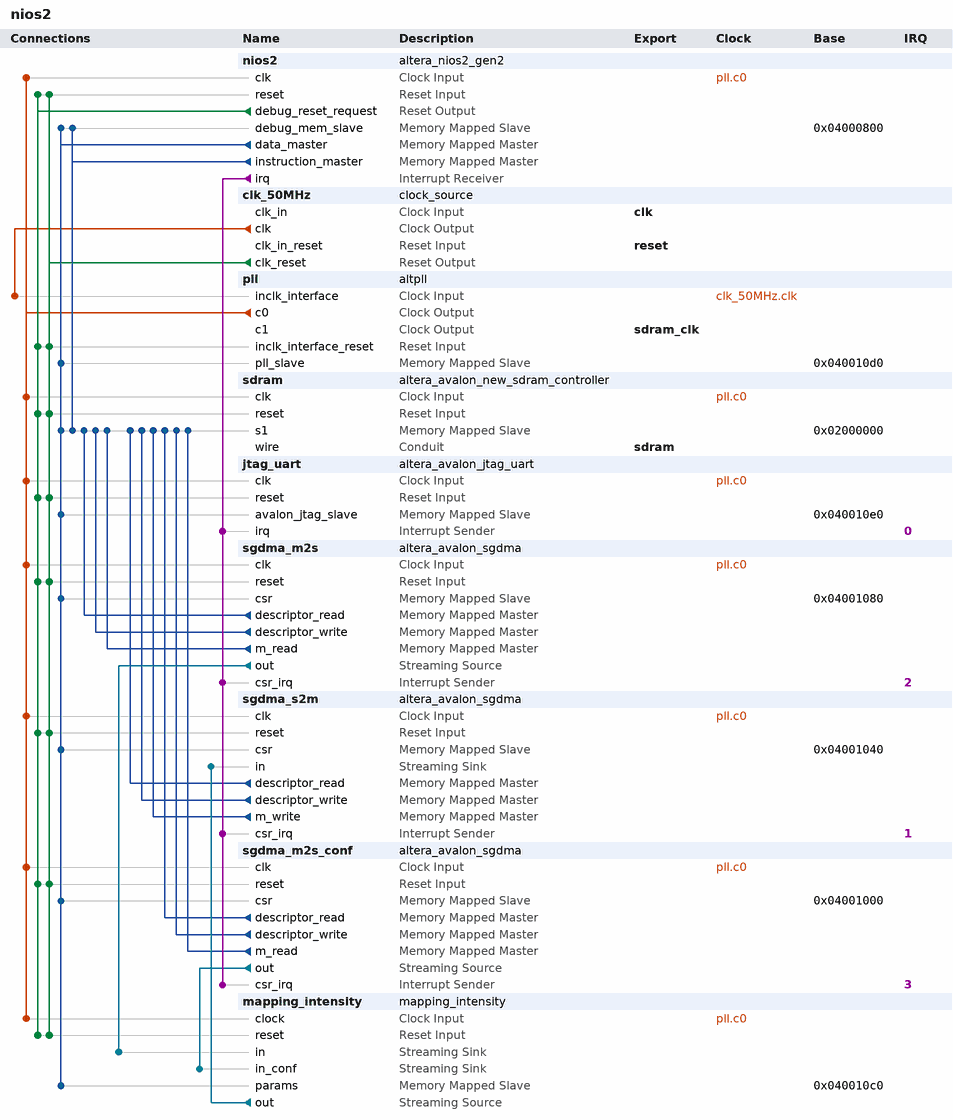
[diagram p0: system contents]
# Platform Designer (Qsys) system nios2, Cyclone IV E EP4CE22F17C6
# Parameters at their usual value, and those the tool derives, are not listed.
package require -exact qsys 17.1
create_system nios2
set_project_property DEVICE_FAMILY {Cyclone IV E}
set_project_property DEVICE EP4CE22F17C6

add_instance nios2 altera_nios2_gen2 17.1
set_instance_parameter_value nios2 dcache_size 2048
set_instance_parameter_value nios2 exceptionSlave sdram.s1
set_instance_parameter_value nios2 icache_size 4096
set_instance_parameter_value nios2 impl Tiny
set_instance_parameter_value nios2 resetSlave sdram.s1

add_instance clk_50MHz clock_source 17.1
set_instance_parameter_value clk_50MHz clockFrequency 50000000

add_instance pll altpll 17.1
set_instance_parameter_value pll CLK0_DIVIDE_BY 1
set_instance_parameter_value pll CLK0_MULTIPLY_BY 1
set_instance_parameter_value pll CLK0_PHASE_SHIFT 3000
set_instance_parameter_value pll CLK1_DIVIDE_BY 1
set_instance_parameter_value pll CLK1_DUTY_CYCLE 50
set_instance_parameter_value pll CLK1_MULTIPLY_BY 1
set_instance_parameter_value pll CLK1_PHASE_SHIFT 0
set_instance_parameter_value pll INCLK0_INPUT_FREQUENCY 20000
set_instance_parameter_value pll PORT_ARESET PORT_UNUSED
set_instance_parameter_value pll PORT_LOCKED PORT_UNUSED
set_instance_parameter_value pll PORT_clk1 PORT_USED
set_instance_parameter_value pll PORT_clk2 PORT_UNUSED
set_instance_parameter_value pll PORT_clk3 PORT_UNUSED

add_instance sdram altera_avalon_new_sdram_controller 17.1
set_instance_parameter_value sdram TAC 5.5
set_instance_parameter_value sdram TRCD 20.0
set_instance_parameter_value sdram TRP 20.0
set_instance_parameter_value sdram casLatency 3
set_instance_parameter_value sdram columnWidth 9
set_instance_parameter_value sdram dataWidth 16
set_instance_parameter_value sdram generateSimulationModel false
set_instance_parameter_value sdram model single_Micron_MT48LC4M32B2_7_chip
set_instance_parameter_value sdram numberOfBanks 4
set_instance_parameter_value sdram numberOfChipSelects 1
set_instance_parameter_value sdram powerUpDelay 100.0
set_instance_parameter_value sdram refreshPeriod 15.625
set_instance_parameter_value sdram rowWidth 13

add_instance jtag_uart altera_avalon_jtag_uart 17.1
set_instance_parameter_value jtag_uart simInteractiveOptions NO_INTERACTIVE_WINDOWS

add_instance sgdma_m2s altera_avalon_sgdma 17.1
set_instance_parameter_value sgdma_m2s enableBurstTransfers false
set_instance_parameter_value sgdma_m2s enableUnalignedTransfers false
set_instance_parameter_value sgdma_m2s readBlockDataWidth 8
set_instance_parameter_value sgdma_m2s sinkErrorWidth 0
set_instance_parameter_value sgdma_m2s sourceErrorWidth 0
set_instance_parameter_value sgdma_m2s transferMode MEMORY_TO_STREAM
set_instance_parameter_value sgdma_m2s writeBurstcountWidth 4

add_instance sgdma_s2m altera_avalon_sgdma 17.1
set_instance_parameter_value sgdma_s2m enableBurstTransfers false
set_instance_parameter_value sgdma_s2m enableUnalignedTransfers false
set_instance_parameter_value sgdma_s2m readBlockDataWidth 8
set_instance_parameter_value sgdma_s2m sinkErrorWidth 0
set_instance_parameter_value sgdma_s2m sourceErrorWidth 0
set_instance_parameter_value sgdma_s2m transferMode STREAM_TO_MEMORY
set_instance_parameter_value sgdma_s2m writeBurstcountWidth 4

add_instance sgdma_m2s_conf altera_avalon_sgdma 17.1
set_instance_parameter_value sgdma_m2s_conf enableBurstTransfers false
set_instance_parameter_value sgdma_m2s_conf enableUnalignedTransfers false
set_instance_parameter_value sgdma_m2s_conf readBlockDataWidth 8
set_instance_parameter_value sgdma_m2s_conf sinkErrorWidth 0
set_instance_parameter_value sgdma_m2s_conf sourceErrorWidth 0
set_instance_parameter_value sgdma_m2s_conf transferMode MEMORY_TO_STREAM
set_instance_parameter_value sgdma_m2s_conf writeBurstcountWidth 4

add_instance mapping_intensity mapping_intensity 1.0
set_instance_parameter_value mapping_intensity CONTROL_REGISTER_WIDTH 8
set_instance_parameter_value mapping_intensity INPUT_BUS_WIDTH 8
set_instance_parameter_value mapping_intensity MAX_NUMBER_OF_PROCESSING_DATA 1000000
set_instance_parameter_value mapping_intensity NUMBER_OF_HISTOGRAM_ELEMENT 256
set_instance_parameter_value mapping_intensity OUTPUT_BUS_WIDTH 8
set_instance_parameter_value mapping_intensity PARAMETER_BUS_WIDTH 32
set_instance_parameter_value mapping_intensity STATUS_REGISTER_WIDTH 8

# connections
add_connection clk_50MHz.clk pll.inclk_interface clock
add_connection pll.c0 jtag_uart.clk clock
add_connection pll.c0 mapping_intensity.clock clock
add_connection pll.c0 nios2.clk clock
add_connection pll.c0 sdram.clk clock
add_connection pll.c0 sgdma_m2s.clk clock
add_connection pll.c0 sgdma_m2s_conf.clk clock
add_connection pll.c0 sgdma_s2m.clk clock
add_connection clk_50MHz.clk_reset jtag_uart.reset reset
add_connection clk_50MHz.clk_reset mapping_intensity.reset reset
add_connection clk_50MHz.clk_reset nios2.reset reset
add_connection clk_50MHz.clk_reset pll.inclk_interface_reset reset
add_connection clk_50MHz.clk_reset sdram.reset reset
add_connection clk_50MHz.clk_reset sgdma_m2s.reset reset
add_connection clk_50MHz.clk_reset sgdma_m2s_conf.reset reset
add_connection clk_50MHz.clk_reset sgdma_s2m.reset reset
add_connection nios2.debug_reset_request jtag_uart.reset reset
add_connection nios2.debug_reset_request mapping_intensity.reset reset
add_connection nios2.debug_reset_request nios2.reset reset
add_connection nios2.debug_reset_request pll.inclk_interface_reset reset
add_connection nios2.debug_reset_request sdram.reset reset
add_connection nios2.debug_reset_request sgdma_m2s.reset reset
add_connection nios2.debug_reset_request sgdma_m2s_conf.reset reset
add_connection nios2.debug_reset_request sgdma_s2m.reset reset
add_connection nios2.data_master jtag_uart.avalon_jtag_slave avalon
set_connection_parameter_value nios2.data_master/jtag_uart.avalon_jtag_slave baseAddress 0x040010e0
add_connection nios2.data_master mapping_intensity.params avalon
set_connection_parameter_value nios2.data_master/mapping_intensity.params baseAddress 0x040010c0
add_connection nios2.data_master nios2.debug_mem_slave avalon
set_connection_parameter_value nios2.data_master/nios2.debug_mem_slave baseAddress 0x04000800
add_connection nios2.data_master pll.pll_slave avalon
set_connection_parameter_value nios2.data_master/pll.pll_slave baseAddress 0x040010d0
add_connection nios2.data_master sdram.s1 avalon
set_connection_parameter_value nios2.data_master/sdram.s1 baseAddress 0x02000000
add_connection nios2.data_master sgdma_m2s.csr avalon
set_connection_parameter_value nios2.data_master/sgdma_m2s.csr baseAddress 0x04001080
add_connection nios2.data_master sgdma_m2s_conf.csr avalon
set_connection_parameter_value nios2.data_master/sgdma_m2s_conf.csr baseAddress 0x04001000
add_connection nios2.data_master sgdma_s2m.csr avalon
set_connection_parameter_value nios2.data_master/sgdma_s2m.csr baseAddress 0x04001040
add_connection nios2.instruction_master nios2.debug_mem_slave avalon
set_connection_parameter_value nios2.instruction_master/nios2.debug_mem_slave baseAddress 0x04000800
add_connection nios2.instruction_master sdram.s1 avalon
set_connection_parameter_value nios2.instruction_master/sdram.s1 baseAddress 0x02000000
add_connection sgdma_m2s.descriptor_read sdram.s1 avalon
set_connection_parameter_value sgdma_m2s.descriptor_read/sdram.s1 baseAddress 0x02000000
add_connection sgdma_m2s.descriptor_write sdram.s1 avalon
set_connection_parameter_value sgdma_m2s.descriptor_write/sdram.s1 baseAddress 0x02000000
add_connection sgdma_m2s.m_read sdram.s1 avalon
set_connection_parameter_value sgdma_m2s.m_read/sdram.s1 baseAddress 0x02000000
add_connection sgdma_m2s_conf.descriptor_read sdram.s1 avalon
set_connection_parameter_value sgdma_m2s_conf.descriptor_read/sdram.s1 baseAddress 0x02000000
add_connection sgdma_m2s_conf.descriptor_write sdram.s1 avalon
set_connection_parameter_value sgdma_m2s_conf.descriptor_write/sdram.s1 baseAddress 0x02000000
add_connection sgdma_m2s_conf.m_read sdram.s1 avalon
set_connection_parameter_value sgdma_m2s_conf.m_read/sdram.s1 baseAddress 0x02000000
add_connection sgdma_s2m.descriptor_read sdram.s1 avalon
set_connection_parameter_value sgdma_s2m.descriptor_read/sdram.s1 baseAddress 0x02000000
add_connection sgdma_s2m.descriptor_write sdram.s1 avalon
set_connection_parameter_value sgdma_s2m.descriptor_write/sdram.s1 baseAddress 0x02000000
add_connection sgdma_s2m.m_write sdram.s1 avalon
set_connection_parameter_value sgdma_s2m.m_write/sdram.s1 baseAddress 0x02000000
add_connection mapping_intensity.out sgdma_s2m.in avalon_streaming
add_connection sgdma_m2s.out mapping_intensity.in avalon_streaming
add_connection sgdma_m2s_conf.out mapping_intensity.in_conf avalon_streaming
add_connection nios2.irq jtag_uart.irq interrupt
set_connection_parameter_value nios2.irq/jtag_uart.irq irqNumber 0
add_connection nios2.irq sgdma_m2s.csr_irq interrupt
set_connection_parameter_value nios2.irq/sgdma_m2s.csr_irq irqNumber 2
add_connection nios2.irq sgdma_m2s_conf.csr_irq interrupt
set_connection_parameter_value nios2.irq/sgdma_m2s_conf.csr_irq irqNumber 3
add_connection nios2.irq sgdma_s2m.csr_irq interrupt
set_connection_parameter_value nios2.irq/sgdma_s2m.csr_irq irqNumber 1

# exported interfaces
add_interface clk clock sink
set_interface_property clk EXPORT_OF clk_50MHz.clk_in
add_interface reset reset sink
set_interface_property reset EXPORT_OF clk_50MHz.clk_in_reset
add_interface sdram conduit end
set_interface_property sdram EXPORT_OF sdram.wire
add_interface sdram_clk clock source
set_interface_property sdram_clk EXPORT_OF pll.c1

set_interconnect_requirement {$system} qsys_mm.clockCrossingAdapter HANDSHAKE
set_interconnect_requirement {$system} qsys_mm.enableEccProtection FALSE
set_interconnect_requirement {$system} qsys_mm.insertDefaultSlave FALSE
set_interconnect_requirement {$system} qsys_mm.maxAdditionalLatency 1

save_system nios2.qsys
